# Altium schematic sheet sensor sch.SchDoc
size A
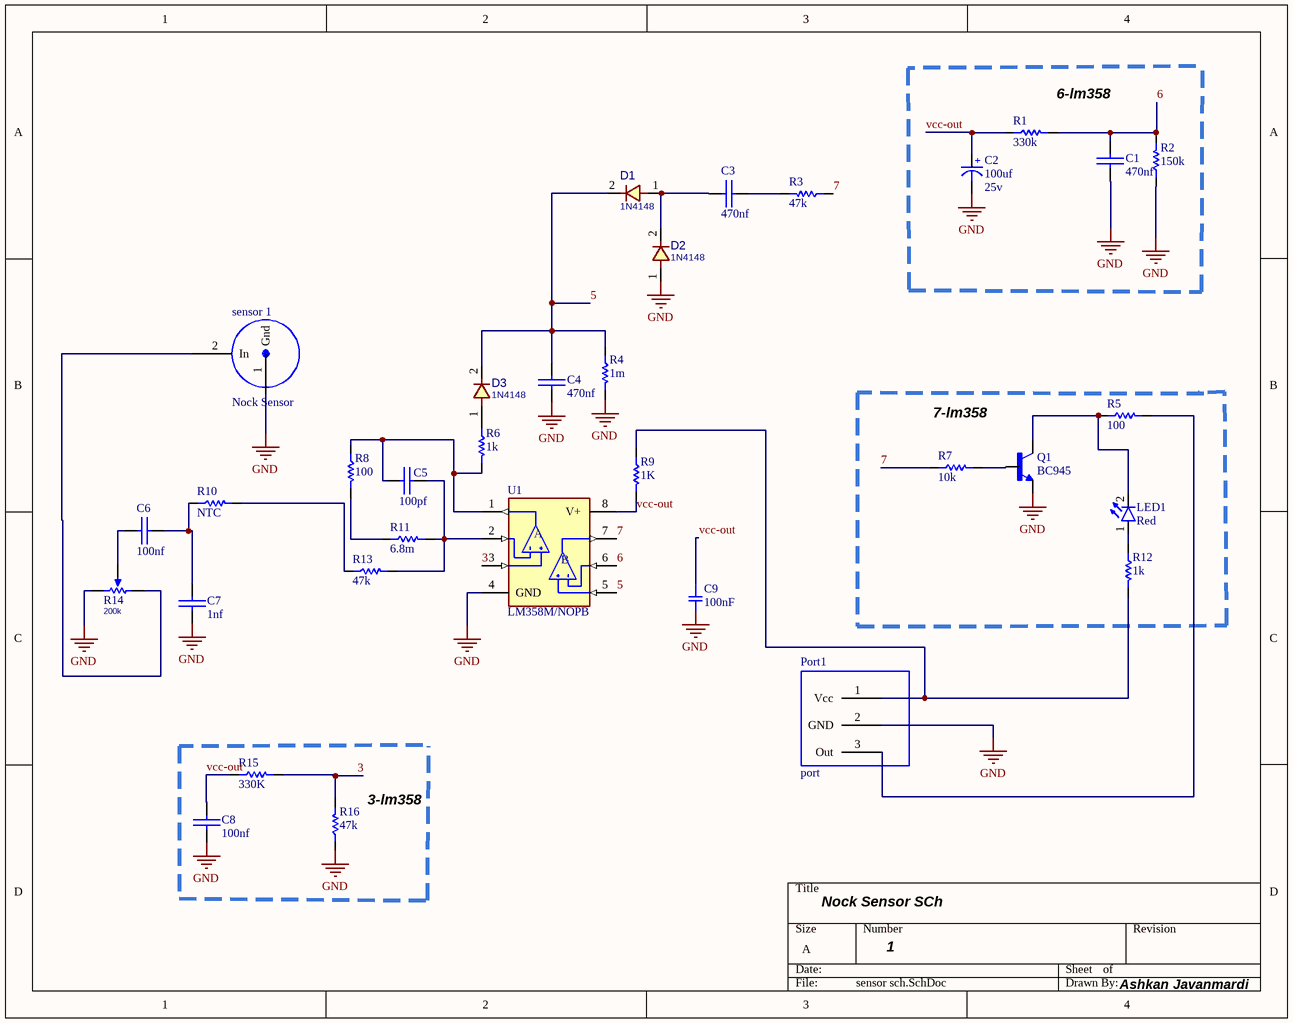
[diagram p0: sensor sch.SchDoc]

## Parts
C1  470nf  [SMD_CAP_0805]
C2  Voltage: 25v  [cap 03]  (hidden comment: 100uf)
C3  470nf  [SMD_CAP_0805]
C4  470nf  [SMD_CAP_0805]
C5  100pf  [SMD_CAP_0805]
C6  100nf  [SMD_CAP_0805]
C7  1nf  [SMD_CAP_0805]
C8  100nf  [SMD_CAP_0805]
C9  100nF  [SMD-0805C]
D1  1N4148  [D_SOD80]
D2  1N4148  [D_SOD80]
D3  1N4148  [D_SOD80]
LED1  Red  [LED-3mm]
Port1  port  [Port]
Q1  BC945  [SOT23-BEC]
R1  330k  [RES 0805 (2012X06L)]
R2  150k  [RES 0805 (2012X06L)]
R3  47k  [RES 0805 (2012X06L)]
R4  1m  [RES 0805 (2012X06L)]
R5  100  [RES 0805 (2012X06L)]
R6  1k  [RES 0805 (2012X06L)]
R7  10k  [RES 0805 (2012X06L)]
R8  100  [RES 0805 (2012X06L)]
R9  1K  [RES 0805 (2012X06L)]
R10  NTC  [RES 0805 (2012X06L)]
R11  6.8m  [RES 0805 (2012X06L)]
R12  1k  [RES 0805 (2012X06L)]
R13  47k  [RES 0805 (2012X06L)]
R14  200k  [POT_7X5]
R15  330K  [RES 0805 (2012X06L)]
R16  47k  [RES 0805 (2012X06L)]
sensor_1  Nock Sensor  [Sensor]
U1  LM358M/NOPB  [SOIC127P599X175-8N]

## Nets
GND: C1.1(+) C2.2(-) C4.2(-) C7.2(-) C8.2(-) C9.2 D2.1 Port1.2(GND) Q1.E R2.1 R4.2 R14.3(BOT) R16.1 sensor_1.1(Gnd) U1.4(GND)
3: R15.2 R16.2 U1.3(+INA)
5: C4.1(+) D1.2 D3.2 R4.1 U1.5(+INB)
6: C1.2(-) R1.2 R2.2 U1.6(-INB)
7: R3.1 R7.1 U1.7(OUTB)
vcc-out: C2.1(+) C8.1(+) C9.1 R1.1 R9.2 R15.1 U1.8(V+)
NetC3_1: C3.1(+) R3.2
NetC3_2: C3.2(-) D1.1 D2.2
NetC5_1: C5.1(+) R6.2 R8.1 U1.1(OUTA)
NetC5_2: C5.2(-) R11.2 R13.2 U1.2(-INA)
NetC6_1: C6.1(+) C7.1(+) R10.1
NetC6_2: C6.2(-) R14.2(TAP)
NetD3_1: D3.1 R6.1
NetLED1_1: LED1.1(A) R12.1
NetLED1_2: LED1.2(K) Q1.C R5.1
NetPort1_1: Port1.1(Vcc) R9.1
NetPort1_3: Port1.3(Out) R5.2
NetQ1_B: Q1.B R7.2
NetR8_2: R8.2 R11.1
NetR10_2: R10.2 R13.1
NetR14_1: R14.1(TOP) sensor_1.2(In)

Not connected (* = marked no-connect by the designer): R12 2

## Notes on the sheet
- 6-lm358
- 7-lm358
- (near R16) 3-lm358
- Nock Sensor SCh
- 1
- Ashkan Javanmardi
- (in symbol LM358M/NOPB) A; B

## Library data of the parts
C1 C3-C8 = Cap-Bipolar: Bipolar Capacitor; Voltage: 100V; Designer: Saeid Jorablo; Organazation: ControTec; Adding Date: 1387/12/20
  C1 C3 C4: Value: 470nf
  C5: Value: 100pf
  C6 C8: Value: 100nf
  C7: Value: 1nf
C2 = Cap-Polar: Polar Capacitor; Designer: Saeid Jorablo; Organazation: ControTec; Adding Date: 1387/12/20; Value: 100uf
C9 = GC321AD72E153KX01D: CAP CER 0.015UF 250V X7T 0805; Manufacturer: Murata Electronics North America; Factory Stock: 0; Unit Price (USD): 0.27; Minimum Quantity: 1; Value: 0.015µF; Tolerance: ±10%; Datasheets: http://search.murata.co.jp/Ceramy/image/img/A01X/G101/ENG/GC321AD72E153KX01-01.pdf; Image: //media.digikey.com/Renders/Murata%20Renders/0805(GC3)200x125.jpg; Digi-Key Part Number: 490-13987-1-ND; Part Number: GC321AD72E153KX01D; Quantity Available: 4000; @ qty: 0; Packaging: Cut Tape (CT); Series: GC3; Part Status: Active; Voltage: 250V; Temperature Coefficient: X7T; Operating Temperature: -55°C ~ 125°C; Features: -; Ratings: AEC-Q200; Applications: Automotive; Mounting Type: Surface Mount, MLCC; Package / Case: 0805 (2012 Metric); Size / Dimension: 0.079" L x 0.049" W (2.00mm x 1.25mm); Height - Seated (Max): -; Thickness (Max): 0.039" (1.00mm); Lead Spacing: -; Lead Style: -
D1-D3 = DIODE_SMD_1N4148: DIODE, FAST SWTICHING, 0.3A, 0.5W; DESC: DESCRIPTION; PARAM: 75V; PARAM2: 300mA, 0.5W; MANF: MANF; ASSEMBLY: ASSEMBLY; PRICE: PRICE; MANF_P#: 1N4148; VALUE: 1N4148
LED1 = LED: Designer: Saeid Jorablo; Organazation: ControTec; Adding Date: 1387/12/22; Color: Red
Q1 = BCW31*: Bipolar _BJT_ Transistor NPN General Purpose Amplifier Surface Mount; MF: ON Semiconductor; MP: BCW31; Package: SOT-23 ON Semiconductor; Value: *; Availability: Unavailable; SnapEDA_Link: https://www.snapeda.com/parts/BCW31/ON%20Semiconductor/view-part/573820/?ref=snap; Price: None
R1-R13 R15 R16 = Resistor
  R1: Value: 330k
  R2: Value: 150k
  R3 R13 R16: Value: 47k
  R4: Value: 1m
  R5 R8: Value: 100
  R6 R12: Value: 1k
  R7: Value: 10k
  R9: Value: 1K
  R10: Value: NTC
  R11: Value: 6.8m
  R15: Value: 330K
R14 = RES_THD_POT_7X5: RESISTOR, THD, Potentiometer; VALUE: 200k
U1 = LM358M/NOPB: 2-Channel, 1MHz, industry standard, 32V op amp 8-SOIC 0 to 70; MF: Texas Instruments; MP: LM358M; Digi-Key_Part_Number: LM358MX/NOPBTR-ND; SnapEDA_Link: https://www.snapeda.com/parts/LM358M/Texas%20Instruments/view-part/4800527/?ref=snap; Package: SOIC-8 Texas Instruments; DigiKey-Purchase-URL: https://snapeda.com/shop?store=DigiKey&id=4800527; Value: *; Check_prices: https://www.snapeda.com/parts/LM358M/Texas%20Instruments/view-part/4800527/?ref=eda